# Altium schematic sheet InterfacesA_USBFTDI.SchDoc
size A4
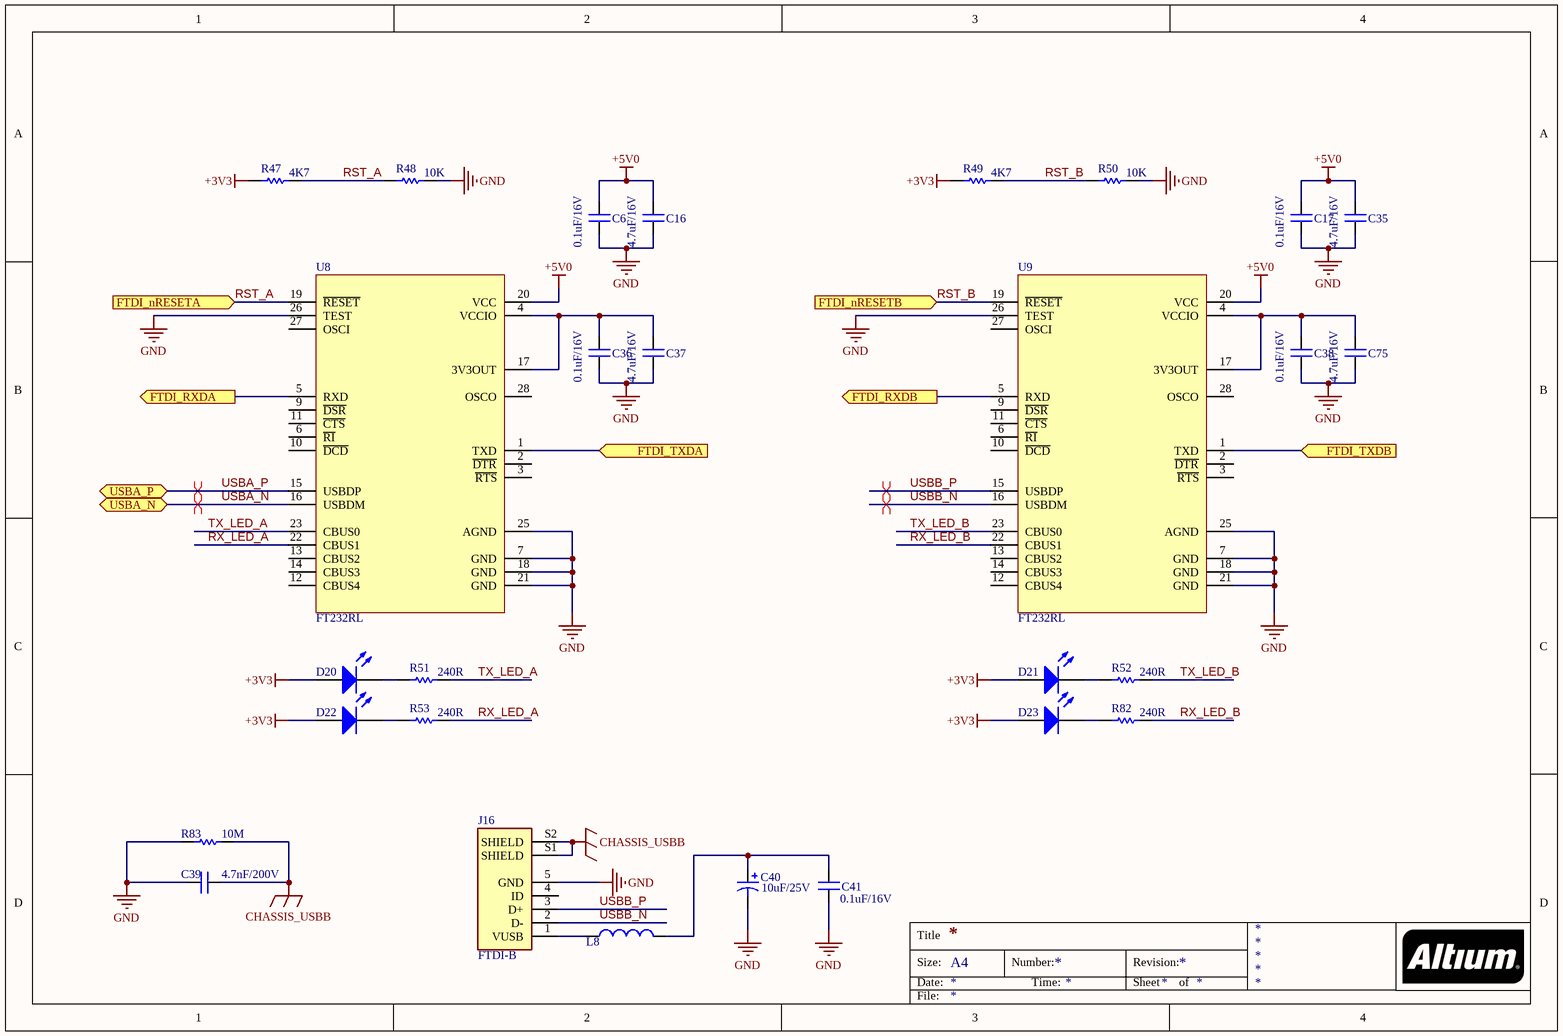
[diagram p0: InterfacesA_USBFTDI.SchDoc]

## Parts
C6  value 0.1uF/16V  [CAP_0805]  (hidden comment: CAP_0805)
C16  value 4.7uF/16V  [CAP_0805]  (hidden comment: CAP_0805)
C17  value 0.1uF/16V  [CAP_0805]  (hidden comment: CAP_0805)
C35  value 4.7uF/16V  [CAP_0805]  (hidden comment: CAP_0805)
C36  value 0.1uF/16V  [CAP_0805]  (hidden comment: CAP_0805)
C37  value 4.7uF/16V  [CAP_0805]  (hidden comment: CAP_0805)
C38  value 0.1uF/16V  [CAP_0805]  (hidden comment: CAP_0805)
C39  value 4.7nF/200V  [CAP_0805]  (hidden comment: CAP_0805)
C40  value 10uF/25V  [CASE-C]  (hidden comment: CASE-C)
C41  value 0.1uF/16V  [CAP_0805]  (hidden comment: CAP_0805)
C75  value 4.7uF/16V  [CAP_0805]  (hidden comment: CAP_0805)
D20  LED_0603  [LED_0603]  (value not drawn)
D21  LED_0603  [LED_0603]  (value not drawn)
D22  LED_0603  [LED_0603]  (value not drawn)
D23  LED_0603  [LED_0603]  (value not drawn)
J16  FTDI-B  [UX60-MB-5S8]
L8  IND_0805  [IND_0805]  (value not drawn)
R47  value 4K7  [RES_0805]  (hidden comment: RES_0805)
R48  value 10K  [RES_0805]  (hidden comment: RES_0805)
R49  value 4K7  [RES_0805]  (hidden comment: RES_0805)
R50  value 10K  [RES_0805]  (hidden comment: RES_0805)
R51  value 240R  [RES_0805]  (hidden comment: RES_0805)
R52  value 240R  [RES_0805]  (hidden comment: RES_0805)
R53  value 240R  [RES_0805]  (hidden comment: RES_0805)
R82  value 240R  [RES_0805]  (hidden comment: RES_0805)
R83  value 10M  [RES_0805]  (hidden comment: RES_0805)
U8  FT232RL  [FT232RL]
U9  FT232RL  [FT232RL]

## Ports
FTDI_nRESETA (in), FTDI_nRESETB (in), FTDI_RXDA (out), FTDI_RXDB (out), FTDI_TXDA (in), FTDI_TXDB (in), USBA_N (bidir), USBA_P (bidir)

## Nets
+3V3: D20.1(A) D21.1(A) D22.1(A) D23.1(A) R47.1 R49.1
+5V0: C6.1 C16.1 C17.1 C35.1 U8.20(VCC) U9.20(VCC)
CHASSIS_USBB: C39.1 J16.S1(SHIELD) J16.S2(SHIELD) R83.1
GND: C6.2 C16.2 C17.2 C35.2 C36.2 C37.2 C38.2 C39.2 C40.K C41.1 C75.2 J16.5(GND) R48.2 R50.2 R83.2 U8.7(GND) U8.18(GND) U8.21(GND) U8.25(AGND) U8.26(TEST) U9.7(GND) U9.18(GND) U9.21(GND) U9.25(AGND) U9.26(TEST)
FTDI_RXDA: U8.5(RXD) ; port FTDI_RXDA
FTDI_RXDB: U9.5(RXD) ; port FTDI_RXDB
FTDI_TXDA: U8.1(TXD) ; port FTDI_TXDA
FTDI_TXDB: U9.1(TXD) ; port FTDI_TXDB
RST_A: R47.2 R48.1 U8.19(~{RESET}) ; port FTDI_nRESETA
RST_B: R49.2 R50.1 U9.19(~{RESET}) ; port FTDI_nRESETB
RX_LED_A: R53.2 U8.22(CBUS1)
RX_LED_B: R82.2 U9.22(CBUS1)
TX_LED_A: R51.2 U8.23(CBUS0)
TX_LED_B: R52.2 U9.23(CBUS0)
USBA_N: U8.16(USBDM) ; port USBA_N
USBA_P: U8.15(USBDP) ; port USBA_P
USBB_N: J16.2(D-) U9.16(USBDM)
USBB_P: J16.3(D+) U9.15(USBDP)
NetC36_1: C36.1 C37.1 U8.4(VCCIO) U8.17(3V3OUT)
NetC38_1: C38.1 C75.1 U9.4(VCCIO) U9.17(3V3OUT)
NetC40_A: C40.A C41.2 L8.2
NetD20_2: D20.2(K) R51.1
NetD21_2: D21.2(K) R52.1
NetD22_2: D22.2(K) R53.1
NetD23_2: D23.2(K) R82.1
NetJ16_1: J16.1(VUSB) L8.1

Not connected (* = marked no-connect by the designer): J16 4(ID); U8 2(~{DTR}) 3(~{RTS}) 6(~{RI}) 9(~{DSR}) 10(~{DCD}) 11(~{CTS}) 12(CBUS4) 13(CBUS2) 14(CBUS3) 27(OSCI) 28(OSCO); U9 2(~{DTR}) 3(~{RTS}) 6(~{RI}) 9(~{DSR}) 10(~{DCD}) 11(~{CTS}) 12(CBUS4) 13(CBUS2) 14(CBUS3) 27(OSCI) 28(OSCO)

## Layout directives
differential pair: USBA_N, USBA_P, USBB_N, USBB_P

## Notes on the sheet
- Title
- Size:
- Date:
- A4
- Number:
- Time:
- Revision:
- Sheet
- of
- File:

## Library data of the parts
C6 C16 C17 C35-C38 C75 = CAP_0603
J16 = UX60-MB-5S8: USB MINI TYPE B
U8 U9 = FT232RL: USB Bridge, USB to UART USB 2.0 UART Interface 28-SSOP; MP: FT232RL-REEL; MF: FTDI,; Digi-Key_Purchase_URL: https://www.digikey.com/product-detail/en/ftdi-future-technology-devices-international-ltd/FT232RL-REEL/768-1007-1-ND/1836402?utm_source=snapeda&utm_medium=aggregator&utm_campaign=symbol; Digi-Key_Part_Number: 768-1007-1-ND; Package: SSOP-28 FTDI; Value: *; SnapEDA_Link: https://www.snapeda.com/parts/FT232RL-REEL/FTDI%2C%20Future%20Technology%20Devices%20International%20Ltd/view-part/45427/?ref=snap